# EAGLE design ArduinoMp3Shield (EAGLE 5.10)
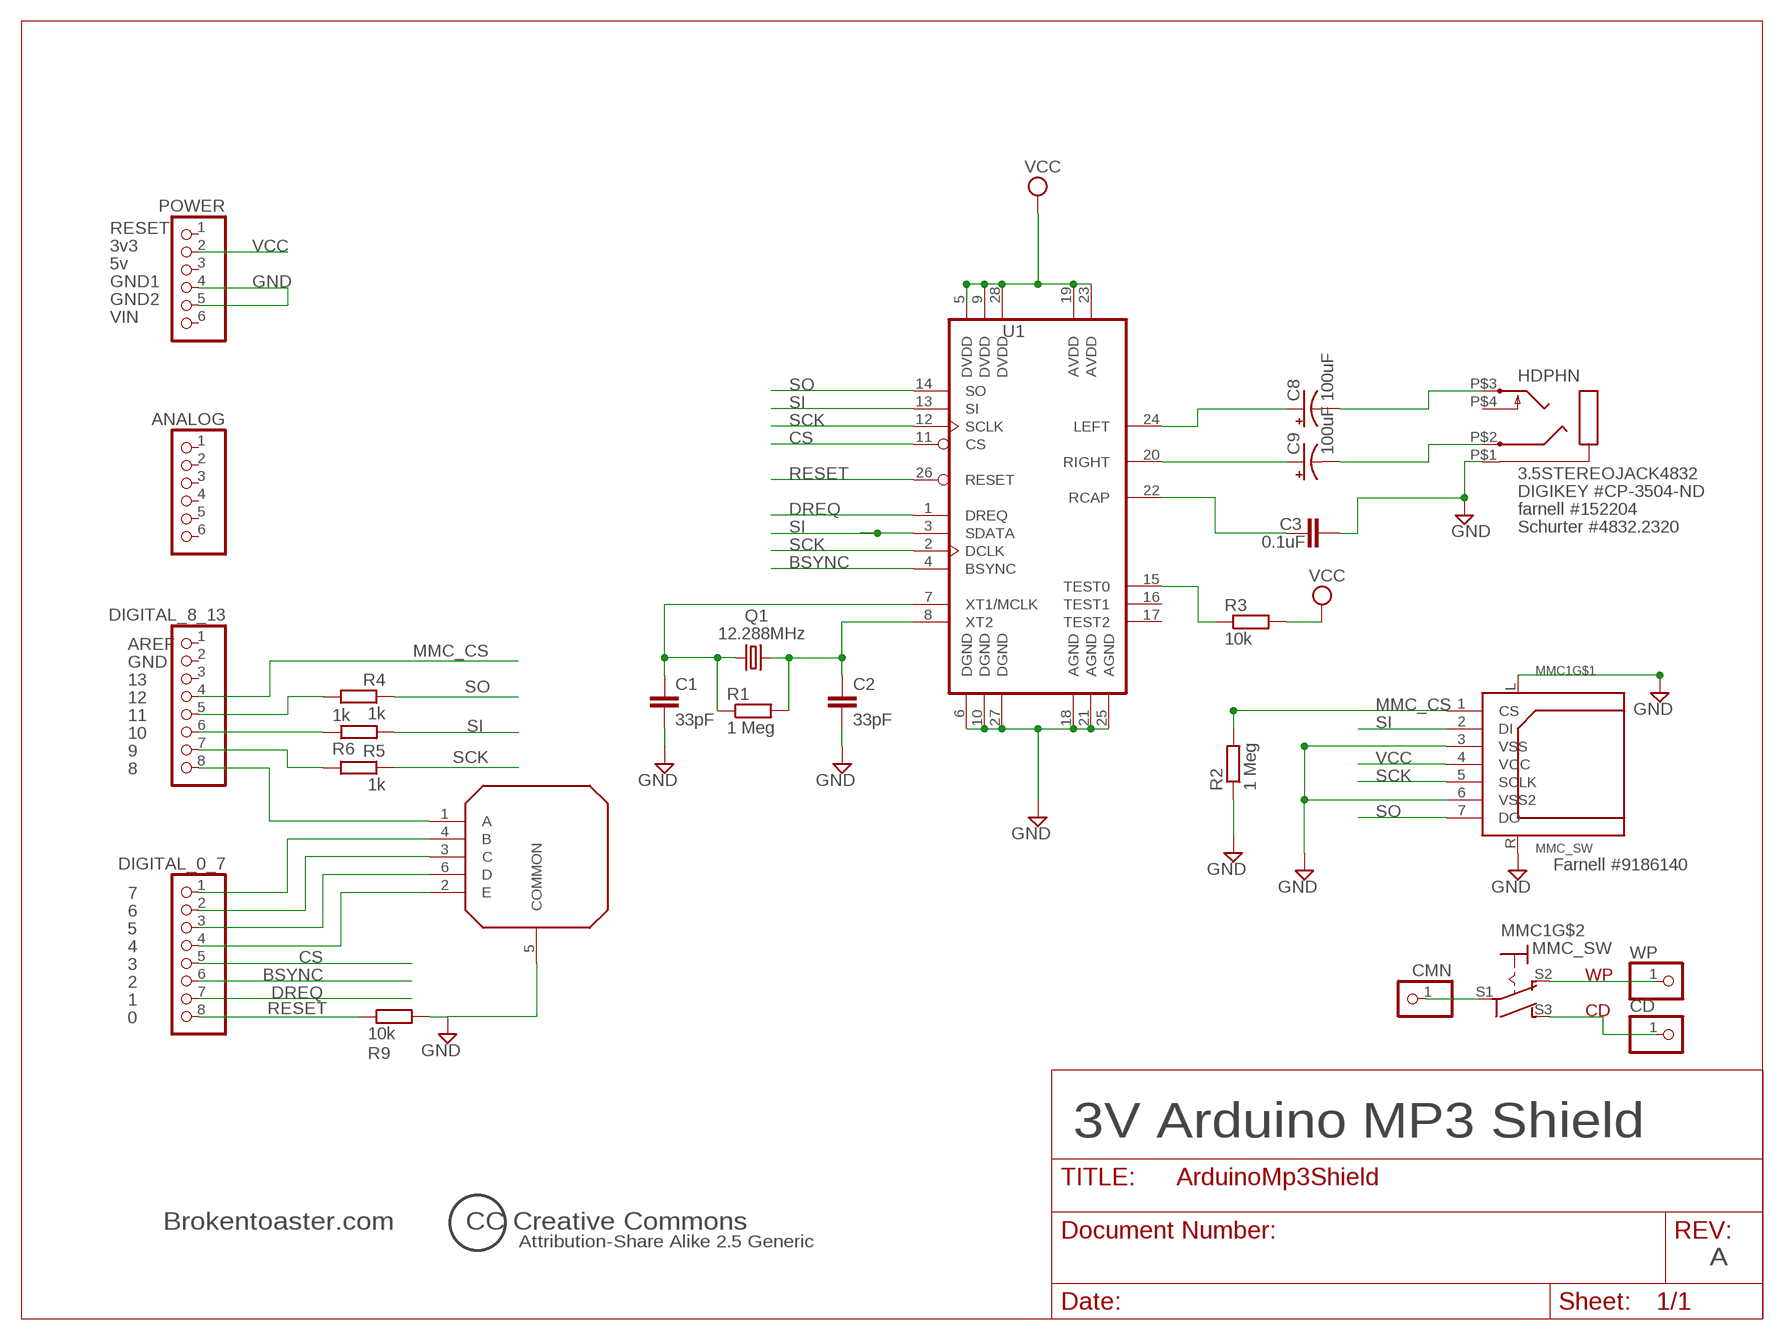
[diagram p0: schematic, sheet 1]

## Parts
ANALOG  1X06  [1X06]
C1  33pF  C-EUC0805K  [C0805K]
C2  33pF  C-EUC0805K  [C0805K]
C3  0.1uF  C-EUC0805K  [C0805K]
C8  100uF  CPOL-USE2.5-6  [E2,5-6]
C9  100uF  CPOL-USE2.5-6  [E2,5-6]
CD  PINHD-1X1  [1X01]
CMN  PINHD-1X1  [1X01]
DIGITAL_0_7  1X08  [1X08]
DIGITAL_8_13  1X08  [1X08]
HDPHN  3.5STEREOJACK4832  [4832-2320]
MMC1  MMC_SW  [SDAMB-01215BT00]
POWER  1X06  [1X06]
Q1  12.288MHz  CRYSTALHC49UP  [HC49UP]
R1  1 Meg  R-EU_R0805  [R0805]
R2  1 Meg  R-EU_R0805  [R0805]
R3  10k  R-EU_R0805  [R0805]
R4  1k  R-EU_R0805  [R0805]
R5  1k  R-EU_R0805  [R0805]
R6  1k  R-EU_R0805  [R0805]
R9  10k  R-EU_R0805  [R0805]
U1  VS1001K  [SOIC-28]
U$5  MCMT5  [MCMT4]
WP  PINHD-1X1  [1X01]

## Nets
BSYNC: DIGITAL_0_7.6 U1.4(BSYNC)
CS: DIGITAL_0_7.5 U1.11(CS)
DREQ: DIGITAL_0_7.7 U1.1(DREQ)
GND: C1.2 C2.2 C3.2 HDPHN.P$1 MMC1.3(VSS) MMC1.6(VSS2) MMC1.L MMC1.R POWER.4 POWER.5 R2.1 R9.2 U1.6(DGND) U1.10(DGND) U1.18(AGND) U1.21(AGND) U1.25(AGND) U1.27(DGND) U$5.5(COMMON)
MMC_CS: DIGITAL_8_13.4 MMC1.1(CS) R2.2
N$1: R3.1 U1.15(TEST0)
N$2: C8.+ U1.24(LEFT)
N$3: C8.- HDPHN.P$3
N$4: C9.+ U1.20(RIGHT)
N$5: C9.- HDPHN.P$2
N$6: DIGITAL_8_13.6 R6.1
N$7: C3.1 U1.22(RCAP)
N$8: DIGITAL_8_13.5 R4.2
N$9: C1.1 Q1.1 R1.1 U1.7(XT1/MCLK)
N$10: C2.1 Q1.2 R1.2 U1.8(XT2)
N$11: DIGITAL_0_7.4 U$5.2(E)
N$12: DIGITAL_0_7.3 U$5.6(D)
N$13: DIGITAL_8_13.7 R5.2
N$14: DIGITAL_0_7.2 U$5.3(C)
N$15: DIGITAL_0_7.1 U$5.4(B)
N$16: DIGITAL_8_13.8 U$5.1(A)
RESET: DIGITAL_0_7.8 R9.1 U1.26(RESET)
SCK: MMC1.5(SCLK) R5.1 U1.2(DCLK) U1.12(SCLK)
SD_SW_CD: CD.1 MMC1.S3(S)
SD_SW_COMM: CMN.1 MMC1.S1(P)
SI: MMC1.2(DI) R6.2 U1.3(SDATA) U1.13(SI)
SO: MMC1.7(DO) R4.1 U1.14(SO)
VCC: MMC1.4(VCC) POWER.2 R3.2 U1.5(DVDD) U1.9(DVDD) U1.19(AVDD) U1.23(AVDD) U1.28(DVDD)
WP: MMC1.S2(O) WP.1
Unconnected: ANALOG.1 ANALOG.2 ANALOG.3 ANALOG.4 ANALOG.5 ANALOG.6 DIGITAL_8_13.1 DIGITAL_8_13.2 DIGITAL_8_13.3 HDPHN.P$4 POWER.1 POWER.3 POWER.6 U1.16(TEST1) U1.17(TEST2)

## Notes on the sheet
- RESET
- 3v3
- 5v
- GND1
- GND2
- VIN
- DIGIKEY #CP-3504-ND
- farnell #152204
- Schurter #4832.2320
- AREF
- GND
- 13
- 12
- 11
- 10
- 9
- 8
- Farnell #9186140
- 7
- 6
- 5
- 4
- 3
- 2
- 1
- 0
- 3V Arduino MP3 Shield
- Brokentoaster.com | CC Creative Commons
- Attribution-Share Alike 2.5 Generic
- A

## Library data of the parts
ANALOG POWER = arduino:1X06: PIN HEADER
C1-C3 = rcl:C-EU: CAPACITOR, European symbol
C8 C9 = ButterflyMP3:CPOL-US: POLARIZED CAPACITOR, American symbol
CD CMN WP = pinhead:PINHD-1X1: PIN HEADER
DIGITAL_0_7 DIGITAL_8_13 = arduino:1X08: PIN HEADER
HDPHN = ButterflyMP3:3.5STEREOJACK: 3.5mm Stero Jack Standard through hole headphone socket. farnell #152204
MMC1 = ButterflyMP3:MMC_SW
Q1 = crystal:CRYSTAL: CRYSTAL
R1-R6 R9 = ButterflyMP3:R-EU_: RESISTOR, European symbol
U1 = ButterflyMP3:VS1001K
U$5 = Switch:MCMT5

## Board
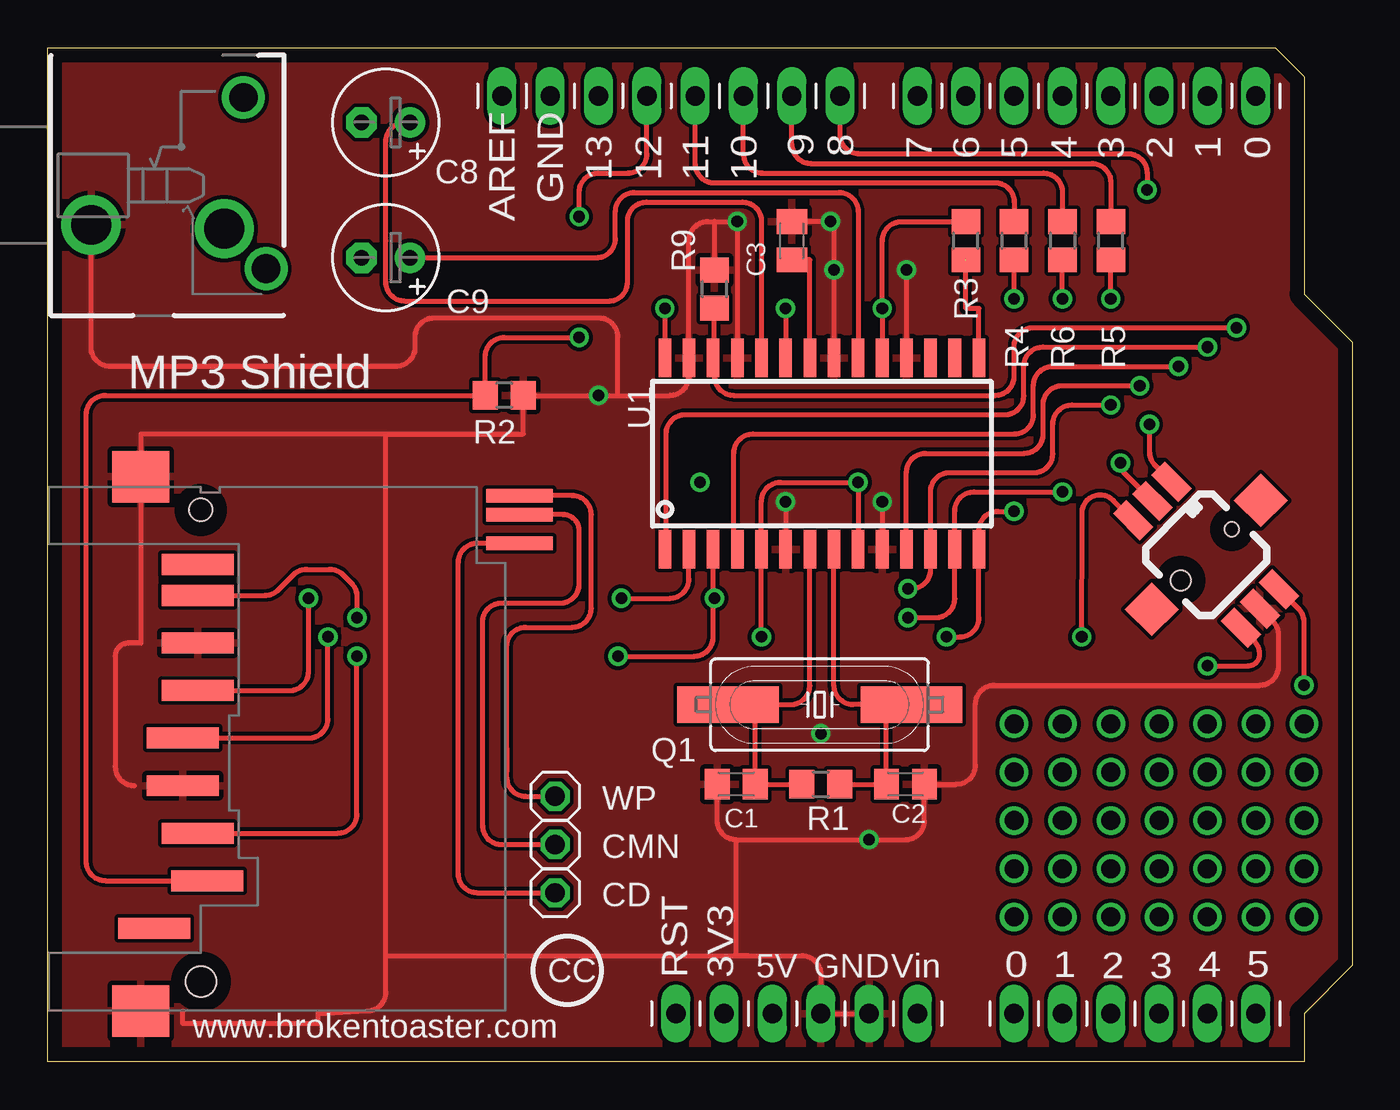
[diagram p1: board, top side]
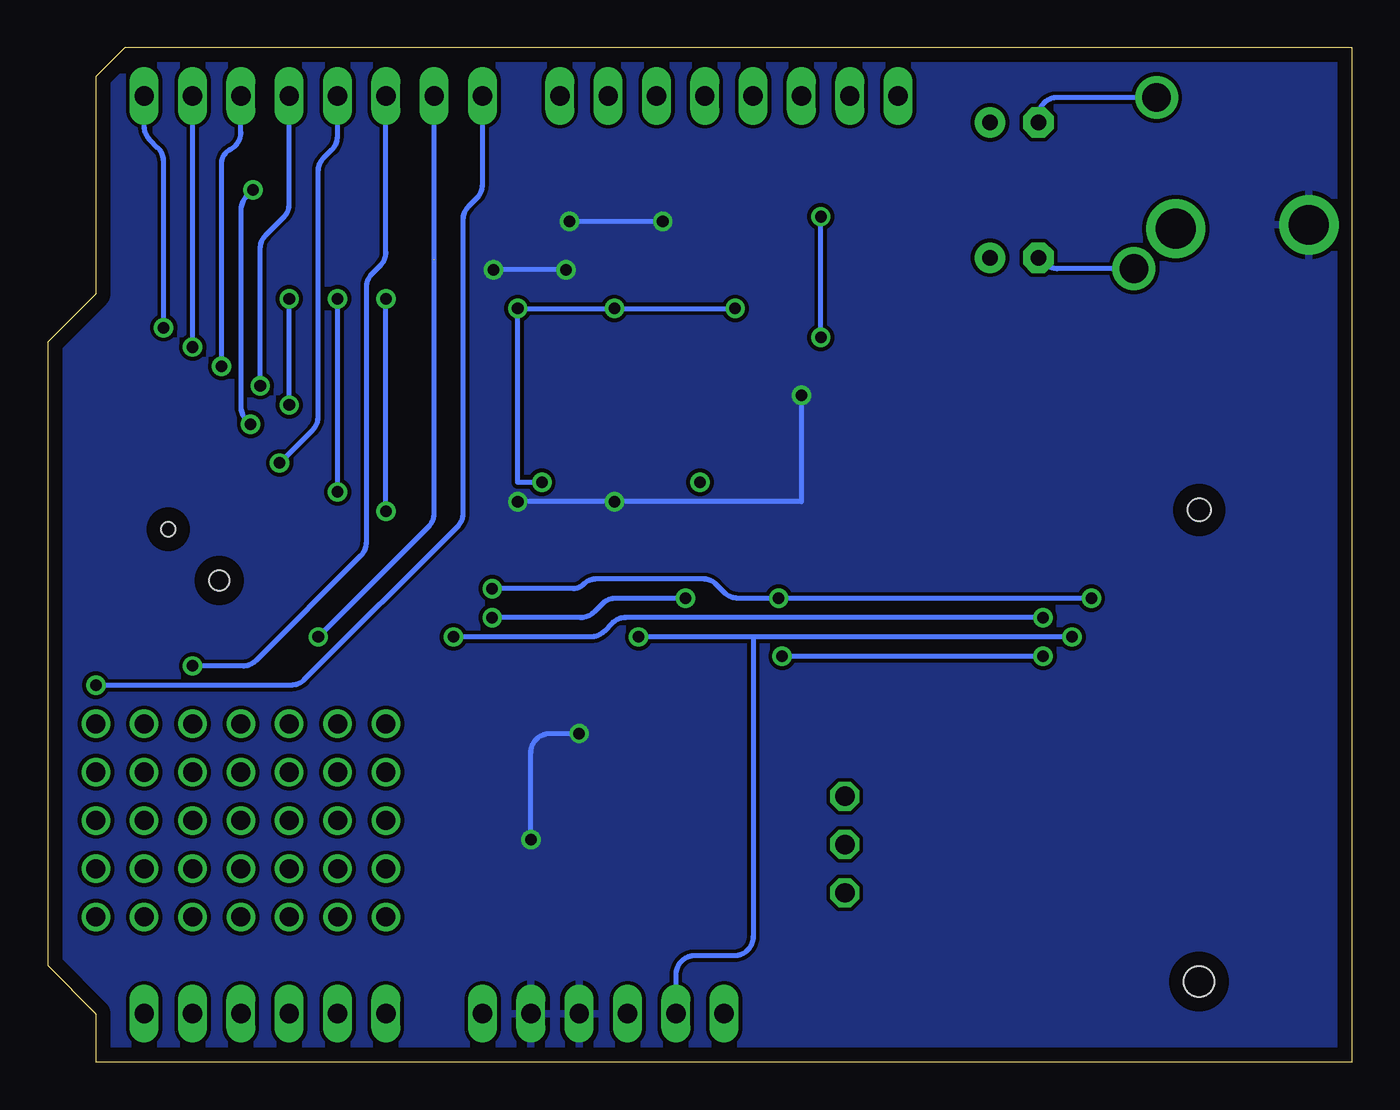
[diagram p2: board, bottom side, seen from below]

Size 68.58 x 53.34 mm. Coordinates in mm from the lower left corner, seen from the top.
Outline: 0,53.34 64.52,53.34 66.04,51.82 66.04,40.39 68.58,37.85 68.58,5.08 66.04,2.54 66.04,0 0,0 0,53.34
Copper layers (1*16): Top 0.035mm / dielectric 1.5mm / Bottom 0.035mm
Design rules "default *": minimum track width 10mil, minimum drill 24mil, track to track 8mil, track to pad 8mil, pad to pad 8mil, via to via 8mil, smd to smd 8mil, copper to edge 30mil, drill to drill 8mil, minimum pad ring 10mil, minimum via ring 8mil, stop-mask expansion 4mil, vias tented up to drill 0mil, thermal gap 10mil

### Footprints (pad centres in the part's own frame; a part is rotated, then mirrored left to right if it is on the bottom)
1X06 = drill 1.016 long: 1 -6.35,0; 2 -3.81,0; 3 -1.27,0; 4 1.27,0; 5 3.81,0; 6 6.35,0
C0805K = smd 1.3 x 1.6: 1 -1,0; 2 1,0
E2,5-6 = drill 0.813 pad 1.6 round: + -1.27,0 | drill 0.813 pad 1.6 octagon: - 1.27,0
1X01 = drill 1.016 octagon: 1 0,0
1X08 = drill 1.016 long: 1 -8.89,0; 2 -6.35,0; 3 -3.81,0; 4 -1.27,0; 5 1.27,0; 6 3.81,0; 7 6.35,0; 8 8.89,0
4832-2320 = drill 2.1 round: P$1 2.5,-2.2; P$4 9.5,-2.4 | drill 1.5 round: P$2 11.7,-4.5; P$3 10.5,4.5
SDAMB-01215BT00 = smd 1.1 x 3.79: 1 -5.3,0.345; 2 -7.8,-0.155; 3 -10.3,-0.955; 4 -12.8,-0.955; 5 -15.3,-0.155; 6 -17.8,-0.155; 7 -20.3,-0.155; 8 -21.925,-0.155; 9 -2.8,-2.455 | smd 2.7 x 3: L -26.55,-3.15; R 1.55,-3.15 | smd 0.7 x 3.5: S1 -24.55,16.75; S2 -25.55,16.75; S3 -23.05,16.75 | hole 1.6: 0,0 | hole 1.2: -24.8,0
HC49UP = smd 5.334 x 1.93: 1 -4.826,0; 2 4.826,0
R0805 = smd 1.3 x 1.5: 1 -1,0; 2 1,0
SOIC-28 = smd 0.66 x 2.032: 1 -6.985,-5.029; 2 -5.715,-5.029; 3 -4.445,-5.029; 4 -3.175,-5.029; 5 -1.905,-5.029; 6 -0.635,-5.029; 7 0.635,-5.029; 8 1.905,-5.029; 9 3.175,-5.029; 10 4.445,-5.029; 11 5.715,-5.029; 12 6.985,-5.029; 13 8.255,-5.029; 14 9.525,-5.029; 15 9.525,5.029; 16 8.255,5.029; 17 6.985,5.029; 18 5.715,5.029; 19 4.445,5.029; 20 3.175,5.029; 21 1.905,5.029; 22 0.635,5.029; 23 -0.635,5.029; 24 -1.905,5.029; 25 -3.175,5.029; 26 -4.445,5.029; 27 -5.715,5.029; 28 -6.985,5.029
MCMT4 = smd 2 x 1: 1 -4,1.425; 2 -4,0; 3 -4,-1.425; 4 4,1.425; 5 4,0; 6 4,-1.425 | smd 2 x 2: NC1 0,4.05; NC2 0,-4.05 | hole 0.75: 0,1.9 | hole 1.05: 0,-1.9

### Placement (x,y rotation side)
ANALOG  57.15,2.54 0 top
C1  36.2,14.61 180 top
C2  45.09,14.61 0 top
C3  39.12,43.18 90 top
C8  17.78,49.4 180 top
C9  17.78,42.29 180 top
CD  26.67,8.89 0 top
CMN  26.67,11.43 0 top
DIGITAL_0_7  54.61,50.8 0 top
DIGITAL_8_13  32.77,50.8 0 top
HDPHN  -0.21,46.22 0 top
MMC1  8.05,4.23 270 top
POWER  39.37,2.54 0 top
Q1  40.58,18.79 0 top
R1  40.64,14.61 0 top
R2  24,35.05 180 top
R3  48.26,43.18 90 top
R4  50.8,43.18 90 top
R5  55.88,43.18 90 top
R6  53.34,43.18 270 top
R9  35.05,40.64 90 top
U1  39.42,31.99 0 top
U$5  60.89,26.67 315 top
WP  26.67,13.97 0 top

### Tracks (layer width: path | path; a pad name or v marks a point on that pad's centre or on a via)
BSYNC  (via drill 0.61)
  Top 0.254: v59.44,36.58 52.82,36.58 arc90 51.82,35.58 51.82,34.02 arc-90 50.82,33.02 37.07,33.02 arc90 36.07,32.02 36.07,26.96 U1.4
  Bottom 0.254: v59.44,36.58 59.44,47.23 arc63 58.97,47.98 arc-63 58.42,48.88 DIGITAL_0_7.6
CS  (via drill 0.61)
  Top 0.254: U1.11 45.14,31 arc-90 46.14,32 51.32,32 arc90 52.32,33 52.32,34.56 arc-90 53.32,35.56 v57.4,35.56
  Bottom 0.254: v57.4,35.56 57.4,42.77 arc45 57.11,43.47 56.17,44.41 arc-45 55.88,45.12 DIGITAL_0_7.5
DREQ  (via drill 0.61)
  Top 0.254: v60.96,37.59 52.31,37.59 arc90 51.31,36.59 51.31,35.04 arc-90 50.31,34.04 33.51,34.04 arc90 32.51,33.04 32.51,26.96 U1.1
  Bottom 0.254: v60.96,37.59 DIGITAL_0_7.7
GND  (via drill 0.61)
  Top 0.254: U1.25 v36.25,44.2 35.05,44.2 | 35.05,44.2 R9.2 | U1.21 v41.33,41.66 41.33,44.2 v41.15,44.2 39.12,44.2 C3.2 | 35.05,44.2 34.71,44.2 arc90 33.71,43.2 U1.27 33.71,36.05 arc-90 32.71,35.05 29.97,35.05 | HDPHN.P$1 2.29,37.58 arc90 3.29,36.58 18.3,36.58 arc90 19.3,37.58 19.3,38.12 arc-90 20.3,39.12 28.97,39.12 arc-90 29.97,38.12 29.97,35.05 | 29.97,35.05 v28.96,35.05 R2.1 25,33.02 17.78,33.02 | 17.78,33.02 4.91,33.02 4.91,22.03 4.25,22.03 arc90 3.56,21.34 3.56,15.53 arc90 4.56,14.53 | 7.11,2.68 7.11,2.03 14.22,2.03 14.22,2.54 16.78,2.68 arc90 17.78,3.68 17.78,5.59 | 17.78,5.59 17.78,33.02 | v45.14,41.66 U1.18 | v43.87,29.46 U1.10 | v38.79,29.46 U1.6 | 36.2,11.68 v43.18,11.68 45.09,11.68 arc90 46.09,12.68 C2.2 47.77,14.61 arc90 48.77,15.61 48.77,18.81 arc-90 49.77,19.81 63.7,19.81 arc90 64.7,20.81 64.7,22.45 arc45 64.41,23.15 U$5.5 | 36.2,11.68 arc-90 35.2,12.68 C1.2 | 17.78,5.59 36.83,5.59 | 36.83,5.59 39.64,5.59 arc-90 40.64,4.59 POWER.4 POWER.5 | 36.2,11.68 36.2,5.59 36.83,5.59
  Bottom 0.254: v36.25,44.2 v41.15,44.2 | v41.33,41.66 v45.14,41.66 | v43.87,29.46 v38.79,29.46 28.96,29.46 v28.96,35.05 | v43.18,11.68 43.18,16.27 arc90 42.18,17.27 v40.64,17.27
  pour Bottom: -2.54,55.88 71.12,55.88 71.12,0 -2.54,0
  pour Top: -5.08,53.34 68.58,53.34 68.58,0 -5.08,0
MMC_CS  (via drill 0.61)
  Top 0.254: v27.94,38.1 24,38.1 arc90 23,37.1 R2.2 3.03,35.05 arc90 2.03,34.05 2.03,10.53 arc90 3.03,9.53 MMC1.1 | v27.94,44.45 27.94,45.74 arc-90 28.94,46.74 30.5,46.74 arc90 31.5,47.74 DIGITAL_8_13.4
  Bottom 0.254: v27.94,38.1 v27.94,44.45
N$1  (1 unrouted)
  Top 0.254: U1.15 48.95,39.62 48.26,39.62 48.26,42.16
N$2
  Top 0.254: U1.24 37.52,44.21 arc90 36.52,45.21 31.48,45.21 arc90 30.48,44.21 30.48,41.91 30.48,41.01 arc-90 29.48,40.01 18.78,40.01 arc-90 17.78,41.01 17.78,43.18 17.78,48.4 arc-90 18.78,49.4 C8.+
N$3
  Bottom 0.254: HDPHN.P$3 15.51,50.72 arc-90 16.51,49.72 C8.-
N$4
  Top 0.254: U1.20 42.6,44.72 arc90 41.6,45.72 30.84,45.72 arc90 29.84,44.72 29.84,43.29 arc-90 28.84,42.29 C9.+
N$5
  Bottom 0.254: HDPHN.P$2 15.52,41.72 arc45 16.23,42.01 C9.-
N$6
  Top 0.254: R6.1 53.34,45.74 arc90 52.34,46.74 37.58,46.74 arc-90 36.58,47.74 DIGITAL_8_13.6
N$7
  Top 0.254: C3.1 40.06,42.18 U1.22
N$8
  Top 0.254: R4.2 50.8,45.23 arc90 49.8,46.23 35.04,46.23 arc-90 34.04,47.23 DIGITAL_8_13.5
N$9
  Top 0.254: U1.7 40.06,19.8 arc-90 39.06,18.8 36.58,18.8 36.58,18.79 | 36.58,18.79 Q1.1 | 36.58,18.79 37.2,18.79 C1.1 R1.1
N$10
  Top 0.254: Q1.2 44.7,18.8 | 44.7,18.8 42.33,18.8 arc-90 41.33,19.8 U1.8 | 44.7,18.8 44.09,18.8 C2.1 R1.2
N$11  (via drill 0.61)
  Top 0.254: U$5.2 56.62,30.95 arc-45 v56.39,31.5
  Bottom 0.254: v56.39,31.5 54.65,33.23 arc-45 54.36,33.94 54.36,46.83 arc45 54.06,47.54 53.63,47.97 arc-45 53.34,48.67 DIGITAL_0_7.4
N$12  (via drill 0.61)
  Top 0.254: U$5.6 63.41,22.14 arc-45 63.7,21.43 arc-90 63.1,20.83 v60.96,20.83
  Bottom 0.254: v60.96,20.83 58.33,20.83 arc-45 57.62,21.12 52.11,26.63 arc-45 51.82,27.34 51.82,40.73 arc45 51.52,41.44 51.09,41.87 arc-45 50.8,42.58 DIGITAL_0_7.3
N$13
  Top 0.254: R5.2 55.88,46.24 arc90 54.88,47.24 40.12,47.24 arc-90 39.12,48.24 DIGITAL_8_13.7
N$14  (via drill 0.61)
  Top 0.254: v54.36,22.35 54.37,28.45 54.37,28.88 arc-90 55.31,29.82 arc-45 56.02,29.53 U$5.3
  Bottom 0.254: v54.36,22.35 48.55,28.16 arc-45 48.26,28.86 DIGITAL_0_7.2
N$15  (via drill 0.61)
  Top 0.254: v66.04,19.81 66.04,23.12 arc45 65.75,23.83 U$5.4
  Bottom 0.254: v66.04,19.81 55.79,19.81 arc-45 55.08,20.11 47.03,28.16 arc-45 46.74,28.86 46.74,44.29 arc45 46.44,45 46.01,45.43 arc-45 45.72,46.13 DIGITAL_0_7.1
N$16  (via drill 0.61)
  Top 0.254: U$5.1 58.2,31.37 arc-45 57.91,32.08 v57.91,33.53 | DIGITAL_8_13.8 41.66,48.75 arc90 42.66,47.75 56.78,47.75 arc-90 57.78,46.75 v57.78,45.85
  Bottom 0.254: v57.91,33.53 58.13,33.74 arc45 58.42,34.45 58.42,44.8 arc45 58.13,45.51 v57.78,45.85
N$17  (via drill 1)
  other vias: 50.8,7.62
N$18  (via drill 1)
  other vias: 66.04,7.62
N$19  (via drill 1)
  other vias: 63.5,7.62
N$20  (via drill 1)
  other vias: 60.96,7.62
N$21  (via drill 1)
  other vias: 58.42,7.62
N$22  (via drill 1)
  other vias: 55.88,7.62
N$23  (via drill 1)
  other vias: 55.88,10.16
N$24  (via drill 1)
  other vias: 58.42,10.16
N$25  (via drill 1)
  other vias: 60.96,10.16
N$26  (via drill 1)
  other vias: 63.5,10.16
N$27  (via drill 1)
  other vias: 66.04,10.16
N$28  (via drill 1)
  other vias: 66.04,12.7
N$29  (via drill 1)
  other vias: 60.96,12.7
N$30  (via drill 1)
  other vias: 63.5,12.7
N$31  (via drill 1)
  other vias: 58.42,12.7
N$32  (via drill 1)
  other vias: 55.88,12.7
N$33  (via drill 1)
  other vias: 53.34,12.7
N$34  (via drill 1)
  other vias: 53.34,10.16
N$35  (via drill 1)
  other vias: 50.8,10.16
N$36  (via drill 1)
  other vias: 50.8,12.7
N$37  (via drill 1)
  other vias: 50.8,15.24
N$38  (via drill 1)
  other vias: 53.34,15.24
N$39  (via drill 1)
  other vias: 55.88,15.24
N$40  (via drill 1)
  other vias: 58.42,15.24
N$41  (via drill 1)
  other vias: 60.96,15.24
N$42  (via drill 1)
  other vias: 63.5,15.24
N$43  (via drill 1)
  other vias: 66.04,15.24
N$44  (via drill 1)
  other vias: 66.04,17.78
N$45  (via drill 1)
  other vias: 63.5,17.78
N$46  (via drill 1)
  other vias: 60.96,17.78
N$47  (via drill 1)
  other vias: 58.42,17.78
N$48  (via drill 1)
  other vias: 55.88,17.78
N$49  (via drill 1)
  other vias: 53.34,17.78
N$50  (via drill 1)
  other vias: 50.8,17.78
N$51  (via drill 0.61)
  other vias: 34.29,30.48
N$52  (via drill 1)
  other vias: 53.34,7.62
RESET  (via drill 0.61)
  Top 0.254: v62.48,38.61 51.8,38.61 arc90 50.8,37.61 50.8,36.05 arc-90 49.8,35.05 36.05,35.05 arc-90 35.05,36.05 35.05,36.07 | 35.05,36.07 35.05,37.02 U1.26 | 35.05,36.07 R9.1
  Bottom 0.254: v62.48,38.61 62.48,47.35 arc-45 62.78,48.06 63.21,48.49 arc45 63.5,49.2 DIGITAL_0_7.8
SCK  (via drill 0.61)
  Top 0.254: v55.88,40.13 R5.1 | v55.88,34.54 53.83,34.54 arc90 52.83,33.54 52.83,31.99 arc-90 51.83,30.99 47.41,30.99 arc90 46.41,29.99 U1.12 46.41,25.89 arc-90 45.41,24.89 v45.21,24.89 | v13.72,24.38 13.72,20.53 arc-90 12.72,19.53 MMC1.5 | v30.15,24.38 32.71,24.38 arc90 33.71,25.38 U1.2
  Bottom 0.254: v55.88,34.54 v55.88,40.13 | v13.72,24.38 v30.15,24.38 32.3,24.38 arc45 33,24.68 33.43,25.11 arc-45 34.14,25.4 39.72,25.4 arc-45 40.42,25.11 arc45 40.94,24.89 v45.21,24.89
SD_SW_CD
  Top 0.254: MMC1.S3 22.59,27.28 arc90 21.59,26.28 21.59,9.89 arc90 22.59,8.89 CD.1
SD_SW_COMM
  Top 0.254: CMN.1 23.86,11.43 arc-90 22.86,12.43 22.86,23.13 arc-90 23.86,24.13 26.94,24.13 arc90 27.94,25.13 27.94,27.94 arc90 27.1,28.78 MMC1.S1
SI  (via drill 0.61)
  Top 0.254: v53.34,40.13 R6.2 | v53.34,29.97 48.68,29.97 arc90 47.68,28.97 U1.13 47.68,24.37 arc-90 46.68,23.37 v45.21,23.37 | v16.26,21.34 16.26,13.03 arc-90 15.26,12.03 MMC1.2 | 34.98,24.38 U1.3 | v29.97,21.34 33.98,21.34 arc90 34.98,22.34 34.98,24.38 | 34.98,24.38 v35.05,24.38
  Bottom 0.254: v53.34,29.97 v53.34,40.13 | v16.26,21.34 v29.97,21.34 | v35.05,24.38 38.72,24.38 arc-45 39.42,24.09 39.85,23.66 arc45 40.56,23.37 v45.21,23.37
SO  (via drill 0.61)
  Top 0.254: v50.8,40.13 R4.1 | v50.8,28.96 49.95,28.96 arc90 48.95,27.96 U1.14 48.95,23.35 arc-90 47.95,22.35 v47.24,22.35 | v16.26,23.37 16.26,24.48 arc45 15.96,25.18 15.53,25.61 arc45 14.83,25.91 13.62,25.91 arc45 12.91,25.61 12.12,24.82 arc-45 11.42,24.53 MMC1.7
  Bottom 0.254: v50.8,28.96 v50.8,40.13 | v47.24,22.35 40.04,22.35 arc-45 39.33,22.64 38.9,23.07 arc45 38.19,23.37 v16.26,23.37
VCC  (via drill 0.61)
  Top 0.254: v14.73,22.35 14.73,18.03 arc-90 13.73,17.03 MMC1.4 | v37.52,22.35 U1.5 37.52,29.48 arc-90 38.52,30.48 v42.6,30.48 U1.9 | U1.19 v43.87,39.62 43.87,43.18 arc-90 44.87,44.18 R3.2 | v32.44,39.62 U1.28 | v38.79,39.62 U1.23
  Bottom 0.254: v14.73,22.35 31.5,22.35 | 31.5,22.35 31.5,6.59 arc90 32.5,5.59 34.56,5.59 arc-90 35.56,4.59 POWER.2 | 31.5,22.35 v37.52,22.35 | v32.44,39.62 v38.79,39.62 v43.87,39.62 43.87,30.48 v42.6,30.48
WP
  Top 0.254: MMC1.S2 27.57,29.78 arc-90 28.57,28.78 28.57,23.86 arc-90 27.57,22.86 25.13,22.86 arc90 24.13,21.86 24.13,16.51 | 24.13,16.51 24.13,15.24 | WP.1 25.13,13.97 arc-90 24.13,14.97 24.13,16.51

### Text on the board
tPlace: MP3 Shield | CC | www.brokentoaster.com
tNames: 9 | 8 | 7 | 6 | 5 | 4 | 3 | 2 | 1 | 0 | 13 | 12 | 11 | 10 | GND | AREF | RST | 3V3 | 5V | GND | Vin | 0 | 1 | 2 | 3 | 4 | 5